# EAGLE design led buttons (EAGLE 8.2.2)
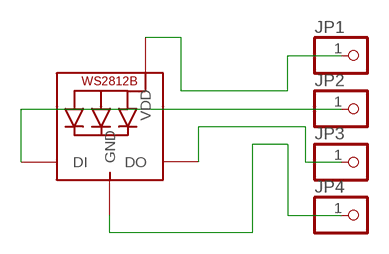
[diagram p0: schematic, sheet 1]

## Parts
JP1  PINHD-1X1  [1X01]
JP2  PINHD-1X1  [1X01]
JP3  PINHD-1X1  [1X01]
JP4  PINHD-1X1  [1X01]
LED1  WS2812B5050  [WS2812B]

## Nets
GND: JP4.1 LED1.3-GND(GND)
N$1: JP1.1 LED1.1-VDD(VDD)
N$3: JP3.1 LED1.2-DOUT(DO)
N$4: JP2.1 LED1.4-DIN(DI)

## Library data of the parts
JP1-JP4 = pinhead:PINHD-1X1: PIN HEADER
LED1 = adafruit:WS2812B

## Board
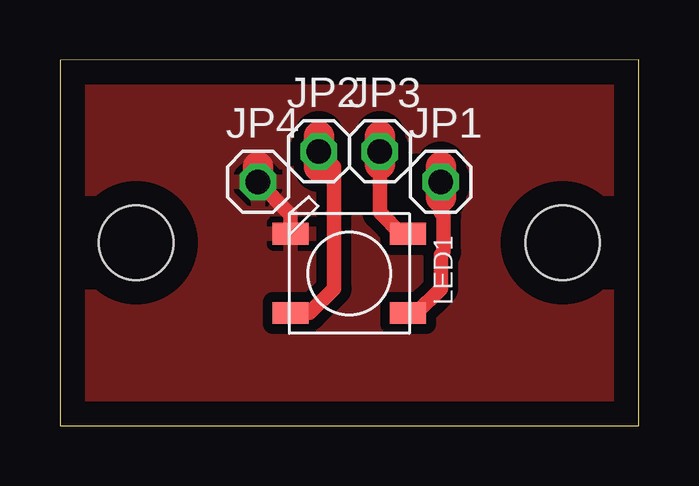
[diagram p1: board, top side]

Size 24.13 x 15.24 mm. Coordinates in mm from the lower left corner, seen from the top.
Outline: 0,0 24.13,0 24.13,15.24 0,15.23 0,0
Copper layers (1*16): Top 0.035mm / dielectric 1.5mm / Bottom 0.035mm
Design rules "fabmodule": minimum track width 10mil, minimum drill 0.4mm, track to track 0.42mm, track to pad 0.42mm, pad to pad 0.42mm, via to via 0.42mm, smd to smd 0.42mm, copper to edge 40mil, drill to drill 0.8mm, minimum pad ring 10mil, minimum via ring 8mil, stop-mask expansion 4mil, vias tented up to drill 0mil, thermal gap 10mil
Holes 3.1 mm at 20.95,7.62 3.17,7.62

### Footprints (pad centres in the part's own frame; a part is rotated, then mirrored left to right if it is on the bottom)
1X01 = drill 1.016 octagon: 1 0,0
WS2812B = smd 1.5 x 0.9: 1-VDD 2.45,-1.65; 2-DOUT 2.45,1.65; 3-GND -2.45,1.65; 4-DIN -2.45,-1.65

### Placement (x,y rotation side)
JP1  15.88,10.16 0 top
JP2  10.79,11.43 0 top
JP3  13.34,11.43 0 top
JP4  8.26,10.16 0 top
LED1  12.06,6.35 0 top

### Tracks (layer width: path | path; a pad name or v marks a point on that pad's centre or on a via)
GND
  Top 0.61: LED1.3-GND 9.62,8.8 JP4.1
  Top 1.27: JP4.1 8.26,10.79
  pour Top: 0,0 24.13,0 24.13,13.97 0,13.97
N$1
  Top 0.61: LED1.1-VDD 14.86,4.7 15.88,5.71 15.88,7.13 15.99,7.25 15.99,8.75 15.88,8.87 15.88,9.53
  Top 1.27: 15.88,10.79 JP1.1 15.88,9.53
N$3
  Top 0.61: LED1.2-DOUT 14.22,8 13.34,8.89 13.34,10.9
  Top 1.27: 13.34,12.06 JP3.1 13.34,10.9
N$4
  Top 0.61: LED1.4-DIN 10.41,4.7 11.43,5.71 11.43,10.79 JP2.1
  Top 1.27: 10.79,12.06 JP2.1 10.79,10.79